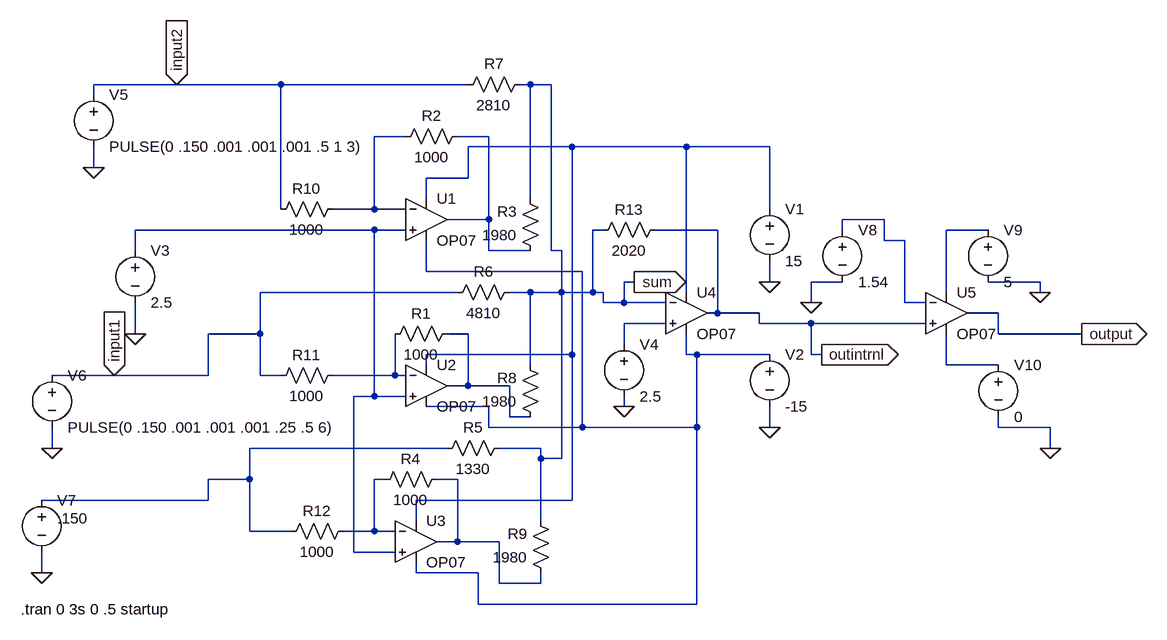
[diagram p0: schematic mem_only_resistor.asc]
mem_only_resistor.asc, the LTspice schematic file:
Version 4
SHEET 1 1024 680
WIRE -512 -176 -640 -176
WIRE -352 -176 -512 -176
WIRE -64 -176 -352 -176
WIRE 32 -176 16 -176
WIRE 64 -176 32 -176
WIRE -640 -160 -640 -176
WIRE -160 -96 -208 -96
WIRE -32 -96 -80 -96
WIRE 96 -80 -64 -80
WIRE 272 -80 96 -80
WIRE 400 -80 272 -80
WIRE -640 -48 -640 -80
WIRE -64 -32 -64 -80
WIRE -64 -32 -128 -32
WIRE -128 0 -128 -32
WIRE 32 0 32 -176
WIRE -352 16 -352 -176
WIRE -208 16 -208 -96
WIRE -208 16 -272 16
WIRE -160 16 -208 16
WIRE 400 16 400 -80
WIRE -32 32 -32 -96
WIRE -32 32 -96 32
WIRE 576 32 512 32
WIRE -208 48 -576 48
WIRE -160 48 -208 48
WIRE 144 48 128 48
WIRE 320 48 224 48
WIRE 512 48 512 32
WIRE 736 48 672 48
WIRE 576 64 576 32
WIRE 608 64 576 64
WIRE -576 80 -576 48
WIRE -32 80 -32 32
WIRE 32 80 -32 80
WIRE 64 80 64 -176
WIRE 80 80 64 80
WIRE -128 112 -128 64
WIRE 112 112 -128 112
WIRE 192 128 176 128
WIRE 400 128 400 96
WIRE 512 128 464 128
WIRE 816 128 736 128
WIRE -80 144 -384 144
WIRE 32 144 0 144
WIRE 80 144 80 80
WIRE 80 144 32 144
WIRE 128 144 128 48
WIRE 128 144 80 144
WIRE 144 144 128 144
WIRE 272 144 272 -80
WIRE 672 144 672 48
WIRE 816 144 816 128
WIRE 144 160 144 144
WIRE 176 160 176 128
WIRE 176 160 144 160
WIRE 240 160 176 160
WIRE 464 160 464 128
WIRE 608 160 608 64
WIRE 640 160 608 160
WIRE 320 176 320 48
WIRE 320 176 304 176
WIRE 384 176 320 176
WIRE 752 176 704 176
WIRE 240 192 176 192
WIRE 384 192 384 176
WIRE 464 192 384 192
WIRE 640 192 464 192
WIRE -576 208 -576 160
WIRE -384 208 -384 144
WIRE -384 208 -464 208
WIRE -64 208 -96 208
WIRE 752 208 752 176
WIRE 880 208 752 208
WIRE 176 224 176 192
WIRE 96 240 96 -80
WIRE 96 240 -128 240
WIRE 272 240 272 208
WIRE 288 240 272 240
WIRE 400 240 288 240
WIRE 464 240 464 192
WIRE 480 240 464 240
WIRE -128 256 -128 240
WIRE 32 256 32 144
WIRE 672 256 672 208
WIRE 752 256 672 256
WIRE -608 272 -704 272
WIRE -464 272 -464 208
WIRE -464 272 -608 272
WIRE -384 272 -384 208
WIRE -352 272 -384 272
WIRE -176 272 -176 208
WIRE -176 272 -272 272
WIRE -160 272 -176 272
WIRE -64 288 -64 208
WIRE -64 288 -96 288
WIRE 0 288 -64 288
WIRE -208 304 -208 48
WIRE -208 304 -240 304
WIRE -160 304 -208 304
WIRE -32 320 -128 320
WIRE 176 320 176 304
WIRE 0 336 0 288
WIRE 32 336 0 336
WIRE -32 352 -32 320
WIRE 112 352 112 112
WIRE 112 352 -32 352
WIRE 288 352 288 240
WIRE 288 352 112 352
WIRE 400 352 400 320
WIRE 752 352 752 336
WIRE 832 352 752 352
WIRE -704 384 -704 352
WIRE -96 384 -400 384
WIRE 48 384 -16 384
WIRE 832 384 832 352
WIRE 48 400 48 384
WIRE 80 400 80 144
WIRE 80 400 48 400
WIRE -400 432 -400 384
WIRE -400 432 -464 432
WIRE -192 432 -208 432
WIRE -80 432 -112 432
WIRE -464 464 -464 432
WIRE -464 464 -720 464
WIRE 96 464 96 240
WIRE 96 464 -144 464
WIRE -144 496 -144 464
WIRE 48 496 48 400
WIRE -400 512 -400 432
WIRE -336 512 -400 512
WIRE -208 512 -208 432
WIRE -208 512 -256 512
WIRE -176 512 -208 512
WIRE -80 528 -80 432
WIRE -80 528 -112 528
WIRE -16 528 -80 528
WIRE -240 544 -240 304
WIRE -176 544 -240 544
WIRE -720 576 -720 544
WIRE -144 576 -144 560
WIRE -48 576 -144 576
WIRE -16 592 -16 528
WIRE 48 592 48 576
WIRE 48 592 -16 592
WIRE -48 624 -48 576
WIRE 288 624 288 352
WIRE 288 624 -48 624
FLAG 400 128 0
FLAG 400 352 0
FLAG -576 208 0
FLAG 176 320 0
FLAG -640 -48 0
FLAG -704 384 0
FLAG -720 576 0
FLAG -608 272 input1
IOPIN -608 272 In
FLAG -512 -176 input2
IOPIN -512 -176 In
FLAG 816 144 0
FLAG 832 384 0
FLAG 464 160 0
FLAG 480 240 outintrnl
IOPIN 480 240 Out
FLAG 192 128 sum
IOPIN 192 128 Out
FLAG 880 208 output
IOPIN 880 208 Out
SYMBOL Opamps\\OP07 -128 -32 R0
SYMATTR InstName U1
SYMBOL Opamps\\OP07 -128 224 R0
SYMATTR InstName U2
SYMBOL Opamps\\OP07 -144 464 R0
SYMATTR InstName U3
SYMBOL Opamps\\OP07 272 112 R0
SYMATTR InstName U4
SYMBOL voltage 400 0 R0
WINDOW 123 0 0 Left 2
WINDOW 39 0 0 Left 2
SYMATTR InstName V1
SYMATTR Value 15
SYMBOL voltage 400 224 R0
WINDOW 123 0 0 Left 2
WINDOW 39 0 0 Left 2
SYMATTR InstName V2
SYMATTR Value -15
SYMBOL res -80 192 R90
WINDOW 0 0 56 VBottom 2
WINDOW 3 32 56 VTop 2
SYMATTR InstName R1
SYMATTR Value 1000
SYMBOL res -64 -112 R90
WINDOW 0 0 56 VBottom 2
WINDOW 3 32 56 VTop 2
SYMATTR InstName R2
SYMATTR Value 1000
SYMBOL res 48 96 R180
WINDOW 0 36 76 Left 2
WINDOW 3 36 40 Left 2
SYMATTR InstName R3
SYMATTR Value 1980
SYMBOL res -96 416 R90
WINDOW 0 0 56 VBottom 2
WINDOW 3 32 56 VTop 2
SYMATTR InstName R4
SYMATTR Value 1000
SYMBOL res 0 368 R90
WINDOW 0 0 56 VBottom 2
WINDOW 3 32 56 VTop 2
SYMATTR InstName R5
SYMATTR Value 1330
SYMBOL res 16 128 R90
WINDOW 0 0 56 VBottom 2
WINDOW 3 32 56 VTop 2
SYMATTR InstName R6
SYMATTR Value 4810
SYMBOL res 32 -192 R90
WINDOW 0 0 56 VBottom 2
WINDOW 3 32 56 VTop 2
SYMATTR InstName R7
SYMATTR Value 2810
SYMBOL res 48 352 R180
WINDOW 0 36 76 Left 2
WINDOW 3 36 40 Left 2
SYMATTR InstName R8
SYMATTR Value 1980
SYMBOL res 64 592 R180
WINDOW 0 36 76 Left 2
WINDOW 3 36 40 Left 2
SYMATTR InstName R9
SYMATTR Value 1980
SYMBOL res -256 0 R90
WINDOW 0 0 56 VBottom 2
WINDOW 3 32 56 VTop 2
SYMATTR InstName R10
SYMATTR Value 1000
SYMBOL res -256 256 R90
WINDOW 0 0 56 VBottom 2
WINDOW 3 32 56 VTop 2
SYMATTR InstName R11
SYMATTR Value 1000
SYMBOL res -240 496 R90
WINDOW 0 0 56 VBottom 2
WINDOW 3 32 56 VTop 2
SYMATTR InstName R12
SYMATTR Value 1000
SYMBOL res 240 32 R90
WINDOW 0 0 56 VBottom 2
WINDOW 3 32 56 VTop 2
SYMATTR InstName R13
SYMATTR Value 2020
SYMBOL voltage -576 64 R0
WINDOW 123 0 0 Left 2
WINDOW 39 0 0 Left 2
SYMATTR InstName V3
SYMATTR Value 2.5
SYMBOL voltage 176 208 R0
WINDOW 123 0 0 Left 2
WINDOW 39 0 0 Left 2
SYMATTR InstName V4
SYMATTR Value 2.5
SYMBOL voltage -640 -176 R0
WINDOW 123 0 0 Left 2
WINDOW 39 0 0 Left 2
SYMATTR InstName V5
SYMATTR Value PULSE(0 .150 .001 .001 .001 .5 1 3)
SYMBOL voltage -704 256 R0
WINDOW 123 0 0 Left 2
WINDOW 39 0 0 Left 2
SYMATTR InstName V6
SYMATTR Value PULSE(0 .150 .001 .001 .001 .25 .5 6)
SYMBOL voltage -720 448 R0
WINDOW 3 24 44 Left 2
WINDOW 123 0 0 Left 2
WINDOW 39 0 0 Left 2
SYMATTR Value .150
SYMATTR InstName V7
SYMBOL Opamps\\OP07 672 112 R0
SYMATTR InstName U5
SYMBOL voltage 736 32 R0
WINDOW 123 0 0 Left 2
WINDOW 39 0 0 Left 2
SYMATTR InstName V9
SYMATTR Value 5
SYMBOL voltage 752 240 R0
WINDOW 123 0 0 Left 2
WINDOW 39 0 0 Left 2
SYMATTR InstName V10
SYMATTR Value 0
SYMBOL voltage 512 32 R0
WINDOW 123 0 0 Left 2
WINDOW 39 0 0 Left 2
SYMATTR InstName V8
SYMATTR Value 1.54
TEXT -752 632 Left 2 !.tran 0 3s 0 .5 startup

The netlist it stands for:
* mem_only_resistor.asc
XU1 N005 N001 N003 N007 N002 LT1001  ; OP07, pins In+ In- V+ V- OUT
XU2 N005 N011 N003 N007 N009 LT1001  ; OP07, pins In+ In- V+ V- OUT
XU3 N005 N013 N003 N007 N014 LT1001  ; OP07, pins In+ In- V+ V- OUT
XU4 N008 sum N003 N007 outintrnl LT1001  ; OP07, pins In+ In- V+ V- OUT
V1 N003 0 15
V2 N007 0 -15
R1 N009 N011 1000
R2 N002 N001 1000
R3 N002 sum 1980
R4 N014 N013 1000
R5 sum N012 1330
R6 sum input1 4810
R7 sum input2 2810
R8 N009 sum 1980
R9 N014 sum 1980
R10 N001 input2 1000
R11 N011 input1 1000
R12 N013 N012 1000
R13 outintrnl sum 2020
V3 N005 0 2.5
V4 N008 0 2.5
V5 input2 0 PULSE(0 .150 .001 .001 .001 .5 1 3)
V6 input1 0 PULSE(0 .150 .001 .001 .001 .25 .5 6)
V7 N012 0 .150
XU5 outintrnl N004 N006 N010 output LT1001  ; OP07, pins In+ In- V+ V- OUT
V9 N006 0 5
V10 N010 0 0
V8 N004 0 1.54
.tran 0 3s 0 .5 startup
.lib LTC.lib
.backanno
.end